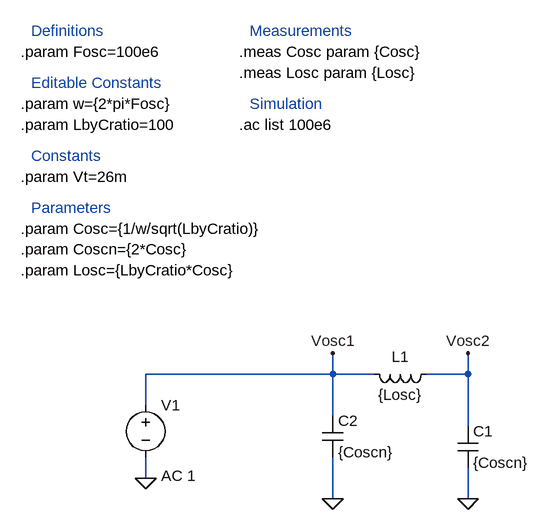
[diagram p0: schematic OscSym.asc]
OscSym.asc, the LTspice schematic file:
Version 4
SHEET 1 880 680
WIRE 336 64 336 32
WIRE 336 64 48 64
WIRE 400 64 336 64
WIRE 544 64 544 32
WIRE 544 64 480 64
WIRE 48 112 48 64
WIRE 336 128 336 64
WIRE 544 144 544 64
WIRE 48 224 48 192
WIRE 336 256 336 192
WIRE 544 256 544 208
FLAG 48 224 0
FLAG 336 256 0
FLAG 544 256 0
FLAG 336 32 Vosc1
FLAG 544 32 Vosc2
SYMBOL voltage 48 96 R0
WINDOW 123 24 124 Left 2
WINDOW 39 0 0 Left 0
SYMATTR Value2 AC 1
SYMATTR InstName V1
SYMATTR Value ""
SYMBOL cap 528 144 R0
SYMATTR InstName C1
SYMATTR Value {Coscn}
SYMBOL cap 320 128 R0
SYMATTR InstName C2
SYMATTR Value {Coscn}
SYMBOL ind 496 48 R90
WINDOW 0 5 56 VBottom 2
WINDOW 3 32 56 VTop 2
SYMATTR InstName L1
SYMATTR Value {Losc}
TEXT -144 -432 Left 2 !.param Fosc=100e6
TEXT -144 -352 Left 2 !.param w={2*pi*Fosc}
TEXT -128 -464 Left 2 ;Definitions
TEXT -128 -272 Left 2 ;Constants
TEXT -128 -192 Left 2 ;Parameters
TEXT -144 -160 Left 2 !.param Cosc={1/w/sqrt(LbyCratio)}
TEXT 208 -464 Left 2 ;Measurements
TEXT 192 -432 Left 2 !.meas Cosc param {Cosc}
TEXT 192 -400 Left 2 !.meas Losc param {Losc}
TEXT -144 -320 Left 2 !.param LbyCratio=100
TEXT -144 -240 Left 2 !.param Vt=26m
TEXT -128 -384 Left 2 ;Editable Constants
TEXT -144 -96 Left 2 !.param Losc={LbyCratio*Cosc}
TEXT 192 -320 Left 2 !.ac list 100e6
TEXT 208 -352 Left 2 ;Simulation
TEXT -144 -128 Left 2 !.param Coscn={2*Cosc}

The netlist it stands for:
* OscSym.asc
V1 Vosc1 0 AC 1
C1 Vosc2 0 {Coscn}
C2 Vosc1 0 {Coscn}
L1 Vosc2 Vosc1 {Losc}
.param Fosc=100e6
.param w={2*pi*Fosc}
* Definitions
* Constants
* Parameters
.param Cosc={1/w/sqrt(LbyCratio)}
* Measurements
.meas Cosc param {Cosc}
.meas Losc param {Losc}
.param LbyCratio=100
.param Vt=26m
* Editable Constants
.param Losc={LbyCratio*Cosc}
.ac list 100e6
* Simulation
.param Coscn={2*Cosc}
.backanno
.end